# EAGLE schematic relay-card (EAGLE 5.11)
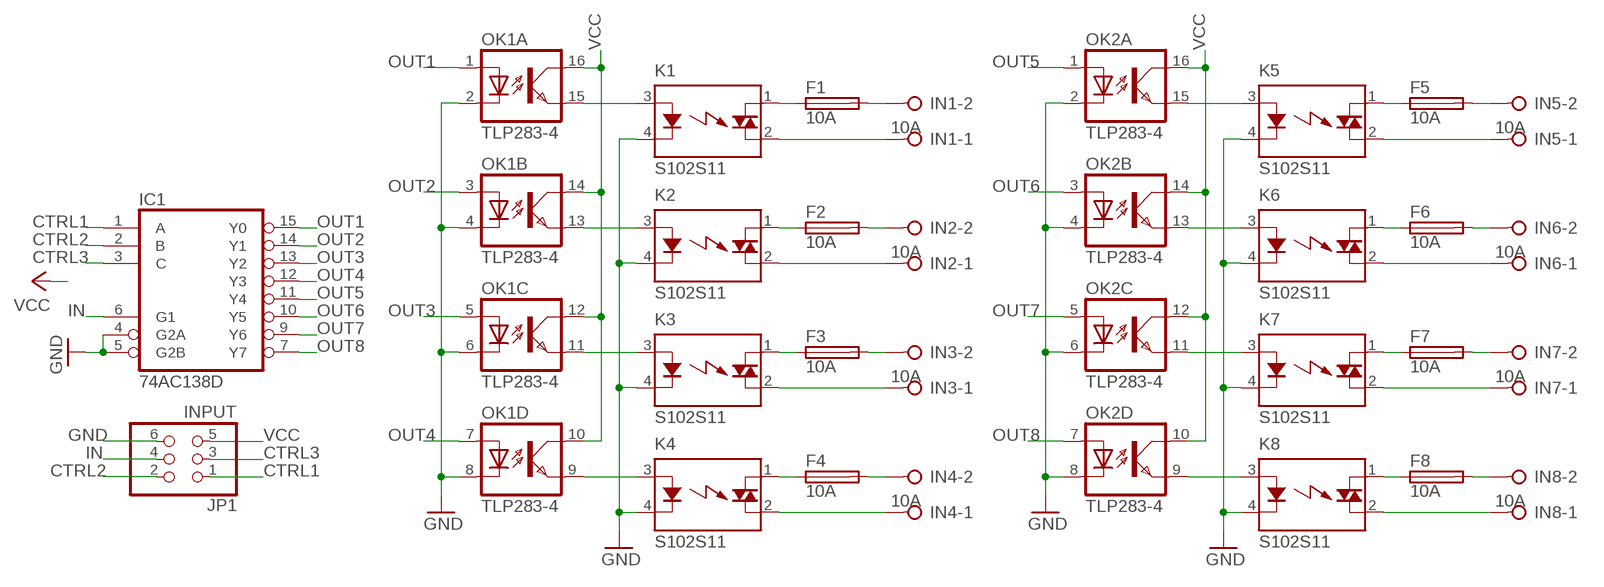
[diagram p0: schematic, sheet 1]

## Parts
F1  10A  SH22,5  [SH22,5]
F2  10A  SH22,5  [SH22,5]
F3  10A  SH22,5  [SH22,5]
F4  10A  SH22,5  [SH22,5]
F5  10A  SH22,5  [SH22,5]
F6  10A  SH22,5  [SH22,5]
F7  10A  SH22,5  [SH22,5]
F8  10A  SH22,5  [SH22,5]
IC1  74AC138D  [SO16]
IN1  10A  W237-02P  [W237-132]
IN2  10A  W237-02P  [W237-132]
IN3  10A  W237-02P  [W237-132]
IN4  10A  W237-02P  [W237-132]
IN5  10A  W237-02P  [W237-132]
IN6  10A  W237-02P  [W237-132]
IN7  10A  W237-02P  [W237-132]
IN8  10A  W237-02P  [W237-132]
JP1  INPUT  PINHD-2X3  [2X03]
K1  S102S11  [S2XXEX]
K2  S102S11  [S2XXEX]
K3  S102S11  [S2XXEX]
K4  S102S11  [S2XXEX]
K5  S102S11  [S2XXEX]
K6  S102S11  [S2XXEX]
K7  S102S11  [S2XXEX]
K8  S102S11  [S2XXEX]
OK1  TLP283-4  [MINI-FLAT-16]
OK2  TLP283-4  [MINI-FLAT-16]

## Nets
CTRL1: IC1.1(A) JP1.1
CTRL2: IC1.2(B) JP1.2
CTRL3: IC1.3(C) JP1.3
GND: IC1.4(G2A) IC1.5(G2B) JP1.6 K1.4(K) K2.4(K) K3.4(K) K4.4(K) K5.4(K) K6.4(K) K7.4(K) K8.4(K) OK1.2(A:C) OK1.4(B:C) OK1.6(C:C) OK1.8(D:C) OK2.2(A:C) OK2.4(B:C) OK2.6(C:C) OK2.8(D:C)
IN: IC1.6(G1) JP1.4
N$3: F1.1 K1.1(DS1)
N$4: F2.1 K2.1(DS1)
N$5: F3.1 K3.1(DS1)
N$6: F4.1 K4.1(DS1)
N$7: F5.1 K5.1(DS1)
N$8: F6.1 K6.1(DS1)
N$9: F7.1 K7.1(DS1)
N$10: F8.1 K8.1(DS1)
N$11: F1.2 IN1.2
N$12: IN1.1 K1.2(DS2)
N$13: F2.2 IN2.2
N$14: IN2.1 K2.2(DS2)
N$15: F3.2 IN3.2
N$16: IN3.1 K3.2(DS2)
N$17: F5.2 IN5.2
N$18: IN5.1 K5.2(DS2)
N$19: F6.2 IN6.2
N$20: IN6.1 K6.2(DS2)
N$21: F7.2 IN7.2
N$22: IN7.1 K7.2(DS2)
N$23: F4.2 IN4.2
N$24: F8.2 IN8.2
N$25: IN8.1 K8.2(DS2)
N$26: IN4.1 K4.2(DS2)
N$27: K1.3(A) OK1.15(A:EMIT)
N$28: K2.3(A) OK1.13(B:EMIT)
N$29: K3.3(A) OK1.11(C:EMIT)
N$30: K4.3(A) OK1.9(D:EMIT)
N$31: K5.3(A) OK2.15(A:EMIT)
N$32: K6.3(A) OK2.13(B:EMIT)
N$33: K7.3(A) OK2.11(C:EMIT)
N$34: K8.3(A) OK2.9(D:EMIT)
OUT1: IC1.15(Y0) OK1.1(A:A)
OUT2: IC1.14(Y1) OK1.3(B:A)
OUT3: IC1.13(Y2) OK1.5(C:A)
OUT4: IC1.12(Y3) OK1.7(D:A)
OUT5: IC1.11(Y4) OK2.1(A:A)
OUT6: IC1.10(Y5) OK2.3(B:A)
OUT7: IC1.9(Y6) OK2.5(C:A)
OUT8: IC1.7(Y7) OK2.7(D:A)
VCC: JP1.5 OK1.10(D:COL) OK1.12(C:COL) OK1.14(B:COL) OK1.16(A:COL) OK2.10(D:COL) OK2.12(C:COL) OK2.14(B:COL) OK2.16(A:COL)

## Power pins joined to a net without a drawn wire
GND: IC1.8(GND)
VCC: IC1.16(VCC)

## Library data of the parts
F1-F8 = fuse:SH22,5: FUSE HOLDER grid 22,5 mm, OGN0031 8201, Schurter (Buerklin); MF: SCHURTER; MPN: 0031.8201; OC_FARNELL: 1162740; OC_NEWARK: 96F8317
IC1 = 74xx-eu:74*138: 3-line to 8-line DECODER/DEMULTIPLEXER
IN1-IN8 = con-wago-508:W237-02P: WAGO SREW CLAMP; OC_FARNELL: unknown; OC_NEWARK: unknown
JP1 = pinhead:PINHD-2X3: PIN HEADER
K1-K8 = relay:S?*: Low Height Type Solid State Relays SHARP Source: 162574-da-01-en-S202T02_Solid_State_Relais.pdf Source: http://sharp-world.com .. s102s11_e.pdf; OC_FARNELL: unknown; OC_NEWARK: unknown
OK1 OK2 = optocoupler:TLP283-4: TOSHIBA PHOTOCOUPLER GaAs IRED & PHOTO-TRANSISTOR Source: http://www.semicon.toshiba.co.jp/td/en/Opto/Photocoupler/en_20050928_TLP283_datasheet.pdf; OC_FARNELL: unknown; OC_NEWARK: unknown